# EAGLE schematic PIC32_circuit (EAGLE 9.3.0)
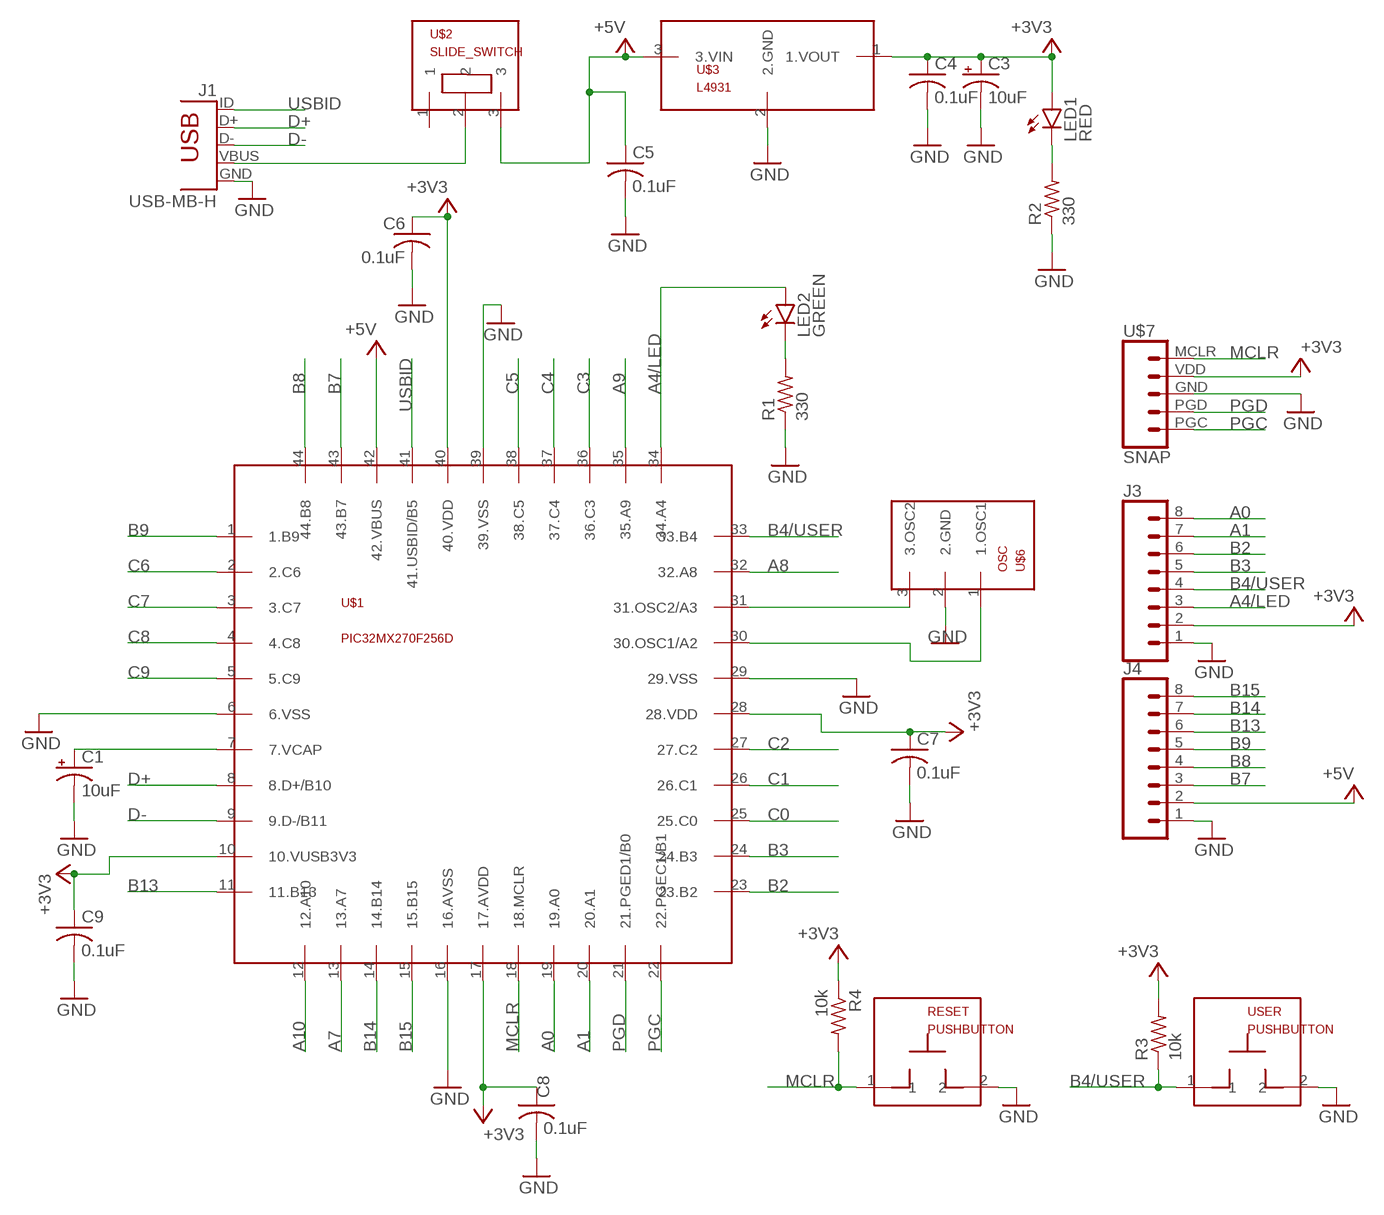
[diagram p0: schematic, sheet 1]

## Parts
C1  10uF  CPOL-USB45181B  [B45181B]
C3  10uF  CPOL-USB45181B  [B45181B]
C4  0.1uF  C-US025-025X050  [C025-025X050]
C5  0.1uF  C-US025-025X050  [C025-025X050]
C6  0.1uF  C-US025-025X050  [C025-025X050]
C7  0.1uF  C-US025-025X050  [C025-025X050]
C8  0.1uF  C-US025-025X050  [C025-025X050]
C9  0.1uF  C-US025-025X050  [C025-025X050]
J1  USB-MB-H  [USB-MB-H]
J3  CONN_08"  [1X08]
J4  CONN_08"  [1X08]
LED1  RED  TLLR4400  [LED3MM]
LED2  GREEN  TLLG4400  [LED3MM]
R1  330  R-US_0207/10  [0207/10]
R2  330  R-US_0207/10  [0207/10]
R3  10k  R-US_0207/10  [0207/10]
R4  10k  R-US_0207/10  [0207/10]
RESET  PUSHBUTTON  [PUSHBUTTON]
U$1  PIC32MX270F256D  [TQFP44]
U$2  SLIDE_SWITCH  [SLIDE_SWITCH]
U$3  L4931  [TO92-LINE]
U$6  OSC  [OSC]
U$7  SNAP  [SNAP]
USER  PUSHBUTTON  [PUSHBUTTON]

## Nets
+3V3: C3.+ C4.1 C6.1 C7.1 C8.1 C9.1 J3.2 LED1.A R3.2 R4.1 U$1.10(10.VUSB3V3) U$1.17(17.AVDD) U$1.28(28.VDD) U$1.40(40.VDD) U$3.1(1.VOUT) U$7.VDD
+5V: C5.1 J4.2 U$1.42(42.VBUS) U$2.3 U$3.3(3.VIN)
A0: J3.8 U$1.19(19.A0)
A1: J3.7 U$1.20(20.A1)
A4/LED: J3.3 LED2.A U$1.34(34.A4)
A7: U$1.13(13.A7)
A8: U$1.32(32.A8)
A9: U$1.35(35.A9)
A10: U$1.12(12.A10)
B2: J3.6 U$1.23(23.B2)
B3: J3.5 U$1.24(24.B3)
B4/USER: J3.4 R3.1 U$1.33(33.B4) USER.1
B7: J4.3 U$1.43(43.B7)
B8: J4.4 U$1.44(44.B8)
B9: J4.5 U$1.1(1.B9)
B13: J4.6 U$1.11(11.B13)
B14: J4.7 U$1.14(14.B14)
B15: J4.8 U$1.15(15.B15)
C0: U$1.25(25.C0)
C1: U$1.26(26.C1)
C2: U$1.27(27.C2)
C3: U$1.36(36.C3)
C4: U$1.37(37.C4)
C5: U$1.38(38.C5)
C6: U$1.2(2.C6)
C7: U$1.3(3.C7)
C8: U$1.4(4.C8)
C9: U$1.5(5.C9)
D+: J1.D+ U$1.8(8.D+/B10)
D-: J1.D- U$1.9(9.D-/B11)
GND: C1.- C3.- C4.2 C5.2 C6.2 C7.2 C8.2 C9.2 J1.GND J3.1 J4.1 R1.1 R2.1 RESET.2 U$1.6(6.VSS) U$1.16(16.AVSS) U$1.29(29.VSS) U$1.39(39.VSS) U$3.2(2.GND) U$6.2(2.GND) U$7.GND USER.2
MCLR: R4.2 RESET.1 U$1.18(18.MCLR) U$7.MCLR
N$1: U$1.31(31.OSC2/A3) U$6.3(3.OSC2)
N$2: U$1.30(30.OSC1/A2) U$6.1(1.OSC1)
N$3: LED1.K(C) R2.2
N$4: LED2.K(C) R1.2
N$6: J1.VBUS U$2.2
N$24: C1.+ U$1.7(7.VCAP)
PGC: U$1.22(22.PGEC1/B1) U$7.PGC
PGD: U$1.21(21.PGED1/B0) U$7.PGD
USBID: J1.ID U$1.41(41.USBID/B5)
Unconnected: U$2.1

## Library data of the parts
C1 C3 = PIC32_parts:CPOL-US: POLARIZED CAPACITOR, American symbol; SPICEPREFIX: C
C4-C9 = PIC32_parts:C-US: CAPACITOR, American symbol; SPICEPREFIX: C
J1 = PIC32_parts:USB: USB Connectors USB-B-PTH is fully proven SKU : PRT-00139/CONN-08278 USB-miniB is fully proven SKU : PRT-00587 USB-A-PCB is untested. USB-A-H is throughly reviewed, but untested. Spark Fun Electronics SKU : PRT-00437 USB-B-SMT is throughly reviewed, but untested. Needs silkscreen touching up. USB-A-S has not been used/tested USB-MB-H has not been used/tested USB-MICROB has been used. CONN-09505
J3 J4 = PIC32_parts:CONN_08: Multi connection point. Often used as Generic Header-pin footprint for 0.1 inch spaced/style header connections On any of the 0.1 inch spaced packages, you can populate with these: Break Away Headers - Straight <https://www.sparkfun.com/products/116> (PRT-00116) Break Away Male Headers - Right Angle <https://www.sparkfun.com/products/553> (PRT-00553) Female Headers <https://www.sparkfun.com/products/115> (PRT-00115) Break Away Headers - Machine Pin <https://www.sparkfun.com/products/117> (PRT-00117) Break Away Female Headers - Swiss Machine Pin <https://www.sparkfun.com/products/743> (PRT-00743) Arduino Stackable Header - 8 Pin <https://www.sparkfun.com/products/9279> (PRT-09279) For SCREWTERMINALS and SPRING TERMINALS visit here: Screw Terimnals on SparkFun.com <https://www.sparkfun.com/search/results?term=Screw+Terminals> (5mm/3.5mm/2.54mm spacing) This device is also useful as a general connection point to wire up your design to another part of your project. Our various solder wires solder well into these plated through hole pads. Hook-Up Wire - Assortment (Stranded, 22 AWG) <https://www.sparkfun.com/products/11375> (PRT-11375) Hook-Up Wire - Assortment (Solid Core, 22 AWG) <https://www.sparkfun.com/products/11367> (PRT-11367) View the entire wire category on our website here <https://www.sparkfun.com/categories/141> Special notes: Molex polarized connector foot print use with SKU : PRT-08231 with associated crimp pins and housings. 1MM SMD Version SKU: PRT-10208 NOTES ON THE VARIANTS LOCK and LOCK_LONGPADS... This footprint was designed to help hold the alignment of a through-hole component (i.e. 6-pin header) while soldering it into place. You may notice that each hole has been shifted either up or down by 0.005 of an inch from it's more standard position (which is a perfectly straight line). This slight alteration caused the pins (the squares in the middle) to touch the edges of the holes. Because they are alternating, it causes a "brace" to hold the component in place. 0.005 has proven to be the perfect amount of "off-center" position when using our standard breakaway headers. Although looks a little odd when you look at the bare footprint, once you have a header in there, the alteration is very hard to notice. Also,if you push a header all the way into place, it is covered up entirely on the bottom side.; PROD_ID: CONN-08438
LED1 = led:TLLR4400: Low Current (2mA) LED 3 mm Tinted Diffused Package color RED Source: Data sheet <http://www.farnell.com/datasheets/391100.pdf>; MF: VISHAY SEMICONDUCTOR; OC_FARNELL: 1612437
LED2 = led:TLLG4400: Low Current (2mA) LED 3 mm Tinted Diffused Package color GREEN Source: Data sheet <http://www.farnell.com/datasheets/391098.pdf>; MF: VISHAY SEMICONDUCTOR; OC_FARNELL: 1612435
R1-R4 = PIC32_parts:R-US_: RESISTOR, American symbol; SPICEPREFIX: R
RESET USER = PIC32_parts:PUSHBUTTON
U$1 = PIC32_parts:PIC32MX270F256D
U$2 = PIC32_parts:SLIDE_SWITCH
U$3 = PIC32_parts:L4931
U$6 = PIC32_parts:OSC
U$7 = PIC32_parts:SNAP